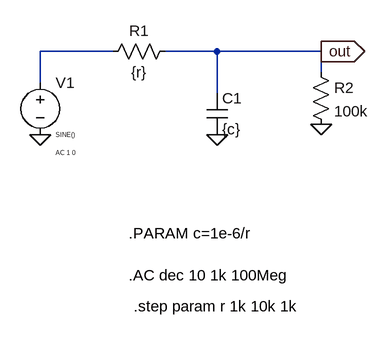
[diagram p0: schematic QUESTION7.asc]
QUESTION7.asc, the LTspice schematic file:
Version 4
SHEET 1 880 680
WIRE 16 160 -96 160
WIRE 176 160 96 160
WIRE 336 160 176 160
WIRE 336 192 336 160
WIRE -96 208 -96 160
WIRE 176 224 176 160
FLAG -96 288 0
FLAG 176 288 0
FLAG 336 160 out
IOPIN 336 160 Out
FLAG 336 272 0
SYMBOL res 112 144 R90
WINDOW 0 0 56 VBottom 2
WINDOW 3 32 56 VTop 2
SYMATTR InstName R1
SYMATTR Value {r}
SYMBOL cap 160 224 R0
SYMATTR InstName C1
SYMATTR Value {c}
SYMBOL voltage -96 192 R0
WINDOW 3 24 96 Left 0
WINDOW 123 24 124 Left 0
WINDOW 39 0 0 Left 0
SYMATTR InstName V1
SYMATTR Value SINE()
SYMATTR Value2 AC 1 0
SYMBOL res 320 176 R0
SYMATTR InstName R2
SYMATTR Value 100k
TEXT 40 440 Left 2 !.PARAM c=1e-6/r
TEXT 40 504 Left 2 !.AC dec 10 1k 100Meg
TEXT 48 552 Left 2 !.step param r 1k 10k 1k

The netlist it stands for:
* QUESTION7.asc
R1 out N001 {r}
C1 out 0 {c}
V1 N001 0 SINE() AC 1 0
R2 out 0 100k
.PARAM c=1e-6/r
.AC dec 10 1k 100Meg
.step param r 1k 10k 1k
.backanno
.end